# Altium schematic sheet Dragonquad.SchDoc
size A
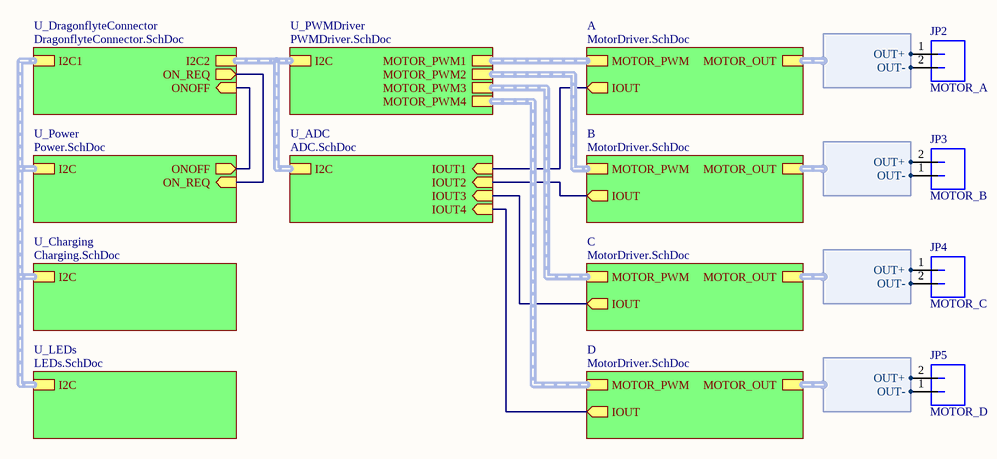
[diagram p0: Dragonquad.SchDoc]

## Parts
JP2  MOTOR_A  [MOLEX-PICOBLADE-1.25MM-2-HORZ-SMD]
JP3  MOTOR_B  [MOLEX-PICOBLADE-1.25MM-2-HORZ-SMD]
JP4  MOTOR_C  [MOLEX-PICOBLADE-1.25MM-2-HORZ-SMD]
JP5  MOTOR_D  [MOLEX-PICOBLADE-1.25MM-2-HORZ-SMD]

## Sub-sheets
A = MotorDriver.SchDoc: MOTOR_PWM (harness MotorPWM), MOTOR_OUT (harness MotorOut), IOUT (out)
B = MotorDriver.SchDoc: MOTOR_PWM (harness MotorPWM), MOTOR_OUT (harness MotorOut), IOUT (out)
C = MotorDriver.SchDoc: MOTOR_PWM (harness MotorPWM), MOTOR_OUT (harness MotorOut), IOUT (out)
D = MotorDriver.SchDoc: MOTOR_PWM (harness MotorPWM), MOTOR_OUT (harness MotorOut), IOUT (out)
U_ADC = ADC.SchDoc: I2C (harness I2C), IOUT1 (in), IOUT2 (in), IOUT3 (in), IOUT4 (in)
U_Charging = Charging.SchDoc: I2C (harness I2C)
U_DragonflyteConnector = DragonflyteConnector.SchDoc: ONOFF (in), ON_REQ (out), I2C1 (harness I2C), I2C2 (harness I2C)
U_LEDs = LEDs.SchDoc: I2C (harness I2C)
U_Power = Power.SchDoc: ONOFF (out), ON_REQ (in), I2C (harness I2C)
U_PWMDriver = PWMDriver.SchDoc: I2C (harness I2C), MOTOR_PWM1 (harness MotorPWM), MOTOR_PWM2 (harness MotorPWM), MOTOR_PWM3 (harness MotorPWM), MOTOR_PWM4 (harness MotorPWM)

## Harnesses
MotorOut: OUT+, OUT-

## Nets
NetJP2_1: JP2.1 ; sheet A/MOTOR_OUT.OUT+
NetJP2_2: JP2.2 ; sheet A/MOTOR_OUT.OUT-
NetJP3_1: JP3.1 ; sheet B/MOTOR_OUT.OUT-
NetJP3_2: JP3.2 ; sheet B/MOTOR_OUT.OUT+
NetJP4_1: JP4.1 ; sheet C/MOTOR_OUT.OUT+
NetJP4_2: JP4.2 ; sheet C/MOTOR_OUT.OUT-
NetJP5_1: JP5.1 ; sheet D/MOTOR_OUT.OUT-
NetJP5_2: JP5.2 ; sheet D/MOTOR_OUT.OUT+
(unnamed): sheet U_Power/ONOFF, sheet U_DragonflyteConnector/ONOFF
(unnamed): sheet U_Power/ON_REQ, sheet U_DragonflyteConnector/ON_REQ
(unnamed): sheet U_ADC/IOUT1, sheet A/IOUT
(unnamed): sheet U_ADC/IOUT2, sheet B/IOUT
(unnamed): sheet U_ADC/IOUT3, sheet C/IOUT
(unnamed): sheet U_ADC/IOUT4, sheet D/IOUT

## Buses and harness runs
harness sheet A/MOTOR_PWM = sheet U_PWMDriver/MOTOR_PWM1
harness sheet B/MOTOR_PWM = sheet U_PWMDriver/MOTOR_PWM2
harness sheet C/MOTOR_PWM = sheet U_PWMDriver/MOTOR_PWM3
harness sheet D/MOTOR_PWM = sheet U_PWMDriver/MOTOR_PWM4
harness sheet U_ADC/I2C = sheet U_DragonflyteConnector/I2C2 = sheet U_PWMDriver/I2C
harness sheet U_Charging/I2C = sheet U_DragonflyteConnector/I2C1 = sheet U_LEDs/I2C = sheet U_Power/I2C

## Library data of the parts
JP2-JP5 = MOLEX_PICOBLADE_1.25MM_2_HORZ_SMD: Manufacturer: Molex; PartNumber: 53261-0271; Mounting Technology: Surface Mount; PackageReference: PicoBlade-1.25mm